# Altium schematic sheet MCU2.SchDoc
size 420 x 297 mm; Address1: Address1; Address2: Address2; Address3: Address3; Address4: Address4; SheetNumber: 4; SheetTotal: 5; Scale: 1:1; DocumentType: Схема электрическая принципиальная
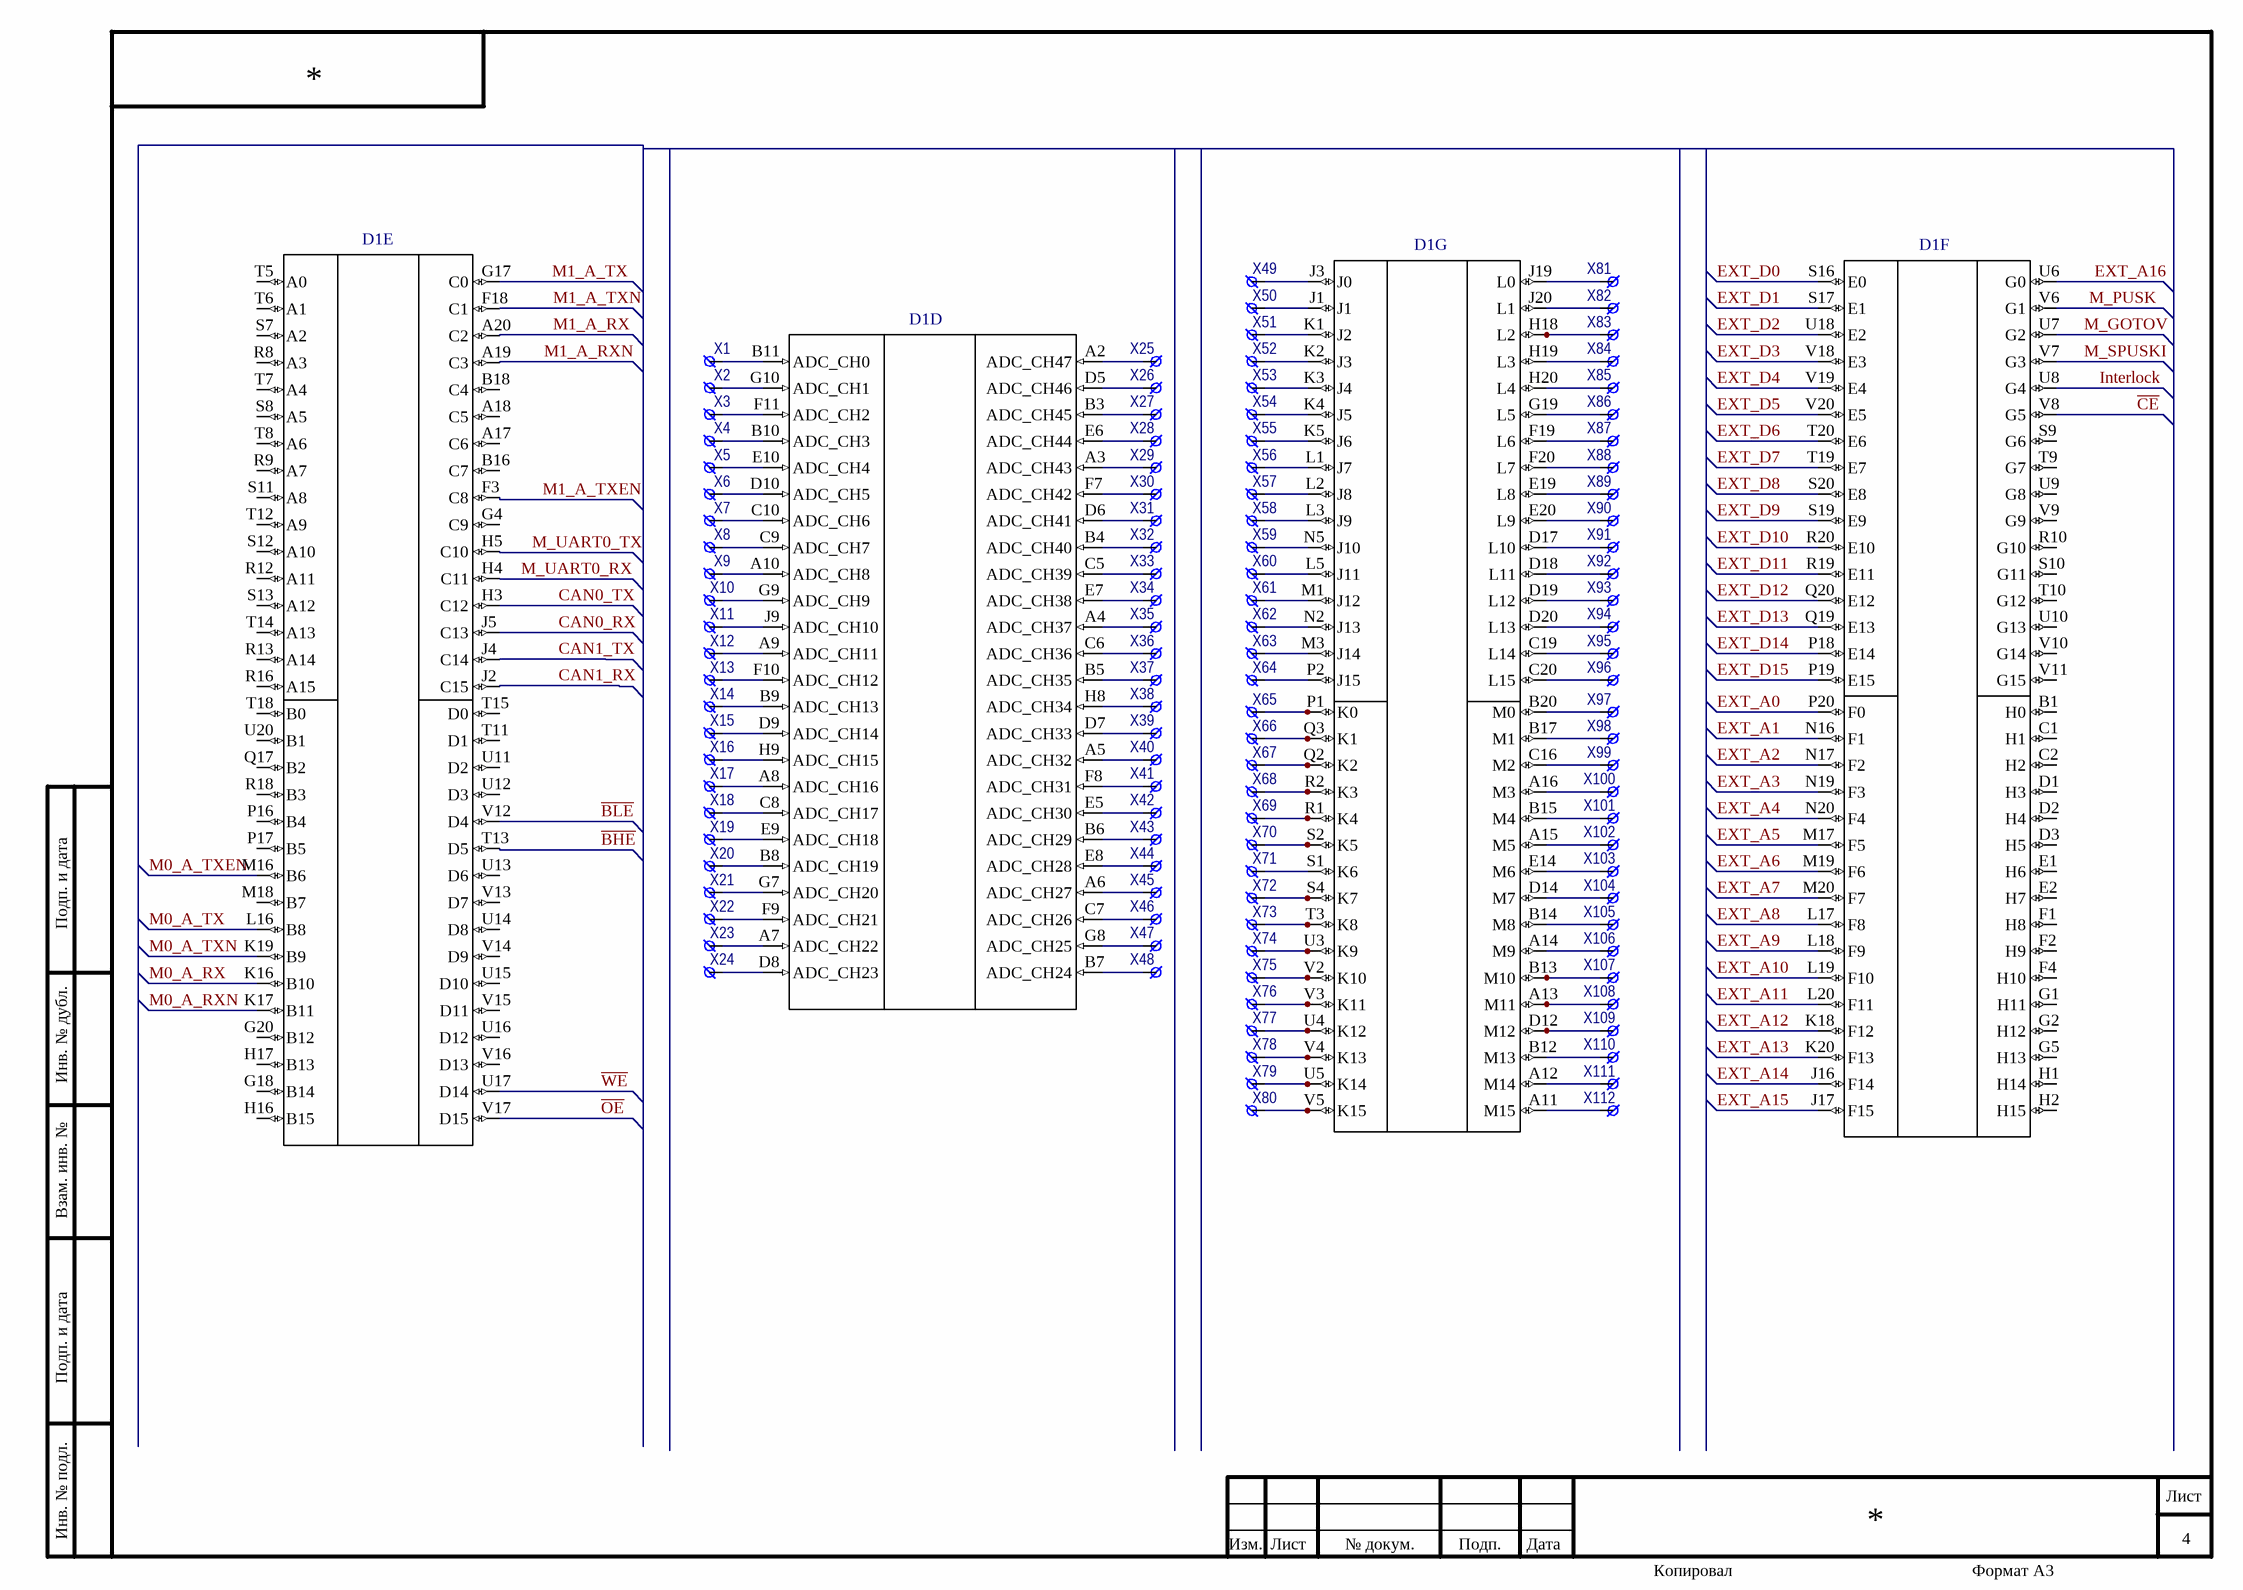
[diagram p0: MCU2.SchDoc]

## Parts
D1  1921ВК028  [BGA-400_21.0X21.0MM_LAYOUT20X20_P1.0MM]  (value not drawn)  (parts D,E,F,G of 8)
X1  CONT  [ПЛАН_ПЛОЩ]  (value not drawn)
X2  CONT  [ПЛАН_ПЛОЩ]  (value not drawn)
X3  CONT  [ПЛАН_ПЛОЩ]  (value not drawn)
X4  CONT  [ПЛАН_ПЛОЩ]  (value not drawn)
X5  CONT  [ПЛАН_ПЛОЩ]  (value not drawn)
X6  CONT  [ПЛАН_ПЛОЩ]  (value not drawn)
X7  CONT  [ПЛАН_ПЛОЩ]  (value not drawn)
X8  CONT  [ПЛАН_ПЛОЩ]  (value not drawn)
X9  CONT  [ПЛАН_ПЛОЩ]  (value not drawn)
X10  CONT  [ПЛАН_ПЛОЩ]  (value not drawn)
X11  CONT  [ПЛАН_ПЛОЩ]  (value not drawn)
X12  CONT  [ПЛАН_ПЛОЩ]  (value not drawn)
X13  CONT  [ПЛАН_ПЛОЩ]  (value not drawn)
X14  CONT  [ПЛАН_ПЛОЩ]  (value not drawn)
X15  CONT  [ПЛАН_ПЛОЩ]  (value not drawn)
X16  CONT  [ПЛАН_ПЛОЩ]  (value not drawn)
X17  CONT  [ПЛАН_ПЛОЩ]  (value not drawn)
X18  CONT  [ПЛАН_ПЛОЩ]  (value not drawn)
X19  CONT  [ПЛАН_ПЛОЩ]  (value not drawn)
X20  CONT  [ПЛАН_ПЛОЩ]  (value not drawn)
X21  CONT  [ПЛАН_ПЛОЩ]  (value not drawn)
X22  CONT  [ПЛАН_ПЛОЩ]  (value not drawn)
X23  CONT  [ПЛАН_ПЛОЩ]  (value not drawn)
X24  CONT  [ПЛАН_ПЛОЩ]  (value not drawn)
X25  CONT  [ПЛАН_ПЛОЩ]  (value not drawn)
X26  CONT  [ПЛАН_ПЛОЩ]  (value not drawn)
X27  CONT  [ПЛАН_ПЛОЩ]  (value not drawn)
X28  CONT  [ПЛАН_ПЛОЩ]  (value not drawn)
X29  CONT  [ПЛАН_ПЛОЩ]  (value not drawn)
X30  CONT  [ПЛАН_ПЛОЩ]  (value not drawn)
X31  CONT  [ПЛАН_ПЛОЩ]  (value not drawn)
X32  CONT  [ПЛАН_ПЛОЩ]  (value not drawn)
X33  CONT  [ПЛАН_ПЛОЩ]  (value not drawn)
X34  CONT  [ПЛАН_ПЛОЩ]  (value not drawn)
X35  CONT  [ПЛАН_ПЛОЩ]  (value not drawn)
X36  CONT  [ПЛАН_ПЛОЩ]  (value not drawn)
X37  CONT  [ПЛАН_ПЛОЩ]  (value not drawn)
X38  CONT  [ПЛАН_ПЛОЩ]  (value not drawn)
X39  CONT  [ПЛАН_ПЛОЩ]  (value not drawn)
X40  CONT  [ПЛАН_ПЛОЩ]  (value not drawn)
X41  CONT  [ПЛАН_ПЛОЩ]  (value not drawn)
X42  CONT  [ПЛАН_ПЛОЩ]  (value not drawn)
X43  CONT  [ПЛАН_ПЛОЩ]  (value not drawn)
X44  CONT  [ПЛАН_ПЛОЩ]  (value not drawn)
X45  CONT  [ПЛАН_ПЛОЩ]  (value not drawn)
X46  CONT  [ПЛАН_ПЛОЩ]  (value not drawn)
X47  CONT  [ПЛАН_ПЛОЩ]  (value not drawn)
X48  CONT  [ПЛАН_ПЛОЩ]  (value not drawn)
X49  CONT  [ПЛАН_ПЛОЩ]  (value not drawn)
X50  CONT  [ПЛАН_ПЛОЩ]  (value not drawn)
X51  CONT  [ПЛАН_ПЛОЩ]  (value not drawn)
X52  CONT  [ПЛАН_ПЛОЩ]  (value not drawn)
X53  CONT  [ПЛАН_ПЛОЩ]  (value not drawn)
X54  CONT  [ПЛАН_ПЛОЩ]  (value not drawn)
X55  CONT  [ПЛАН_ПЛОЩ]  (value not drawn)
X56  CONT  [ПЛАН_ПЛОЩ]  (value not drawn)
X57  CONT  [ПЛАН_ПЛОЩ]  (value not drawn)
X58  CONT  [ПЛАН_ПЛОЩ]  (value not drawn)
X59  CONT  [ПЛАН_ПЛОЩ]  (value not drawn)
X60  CONT  [ПЛАН_ПЛОЩ]  (value not drawn)
X61  CONT  [ПЛАН_ПЛОЩ]  (value not drawn)
X62  CONT  [ПЛАН_ПЛОЩ]  (value not drawn)
X63  CONT  [ПЛАН_ПЛОЩ]  (value not drawn)
X64  CONT  [ПЛАН_ПЛОЩ]  (value not drawn)
X65  CONT  [ПЛАН_ПЛОЩ]  (value not drawn)
X66  CONT  [ПЛАН_ПЛОЩ]  (value not drawn)
X67  CONT  [ПЛАН_ПЛОЩ]  (value not drawn)
X68  CONT  [ПЛАН_ПЛОЩ]  (value not drawn)
X69  CONT  [ПЛАН_ПЛОЩ]  (value not drawn)
X70  CONT  [ПЛАН_ПЛОЩ]  (value not drawn)
X71  CONT  [ПЛАН_ПЛОЩ]  (value not drawn)
X72  CONT  [ПЛАН_ПЛОЩ]  (value not drawn)
X73  CONT  [ПЛАН_ПЛОЩ]  (value not drawn)
X74  CONT  [ПЛАН_ПЛОЩ]  (value not drawn)
X75  CONT  [ПЛАН_ПЛОЩ]  (value not drawn)
X76  CONT  [ПЛАН_ПЛОЩ]  (value not drawn)
X77  CONT  [ПЛАН_ПЛОЩ]  (value not drawn)
X78  CONT  [ПЛАН_ПЛОЩ]  (value not drawn)
X79  CONT  [ПЛАН_ПЛОЩ]  (value not drawn)
X80  CONT  [ПЛАН_ПЛОЩ]  (value not drawn)
X81  CONT  [ПЛАН_ПЛОЩ]  (value not drawn)
X82  CONT  [ПЛАН_ПЛОЩ]  (value not drawn)
X83  CONT  [ПЛАН_ПЛОЩ]  (value not drawn)
X84  CONT  [ПЛАН_ПЛОЩ]  (value not drawn)
X85  CONT  [ПЛАН_ПЛОЩ]  (value not drawn)
X86  CONT  [ПЛАН_ПЛОЩ]  (value not drawn)
X87  CONT  [ПЛАН_ПЛОЩ]  (value not drawn)
X88  CONT  [ПЛАН_ПЛОЩ]  (value not drawn)
X89  CONT  [ПЛАН_ПЛОЩ]  (value not drawn)
X90  CONT  [ПЛАН_ПЛОЩ]  (value not drawn)
X91  CONT  [ПЛАН_ПЛОЩ]  (value not drawn)
X92  CONT  [ПЛАН_ПЛОЩ]  (value not drawn)
X93  CONT  [ПЛАН_ПЛОЩ]  (value not drawn)
X94  CONT  [ПЛАН_ПЛОЩ]  (value not drawn)
X95  CONT  [ПЛАН_ПЛОЩ]  (value not drawn)
X96  CONT  [ПЛАН_ПЛОЩ]  (value not drawn)
X97  CONT  [ПЛАН_ПЛОЩ]  (value not drawn)
X98  CONT  [ПЛАН_ПЛОЩ]  (value not drawn)
X99  CONT  [ПЛАН_ПЛОЩ]  (value not drawn)
X100  CONT  [ПЛАН_ПЛОЩ]  (value not drawn)
X101  CONT  [ПЛАН_ПЛОЩ]  (value not drawn)
X102  CONT  [ПЛАН_ПЛОЩ]  (value not drawn)
X103  CONT  [ПЛАН_ПЛОЩ]  (value not drawn)
X104  CONT  [ПЛАН_ПЛОЩ]  (value not drawn)
X105  CONT  [ПЛАН_ПЛОЩ]  (value not drawn)
X106  CONT  [ПЛАН_ПЛОЩ]  (value not drawn)
X107  CONT  [ПЛАН_ПЛОЩ]  (value not drawn)
X108  CONT  [ПЛАН_ПЛОЩ]  (value not drawn)
X109  CONT  [ПЛАН_ПЛОЩ]  (value not drawn)
X110  CONT  [ПЛАН_ПЛОЩ]  (value not drawn)
X111  CONT  [ПЛАН_ПЛОЩ]  (value not drawn)
X112  CONT  [ПЛАН_ПЛОЩ]  (value not drawn)

## Nets
~{BHE}: D1.T13(D5)
~{BLE}: D1.V12(D4)
~{CE}: D1.V8(G5)
~{OE}: D1.V17(D15)
~{WE}: D1.U17(D14)
CAN0_RX: D1.J5(C13)
CAN0_TX: D1.H3(C12)
CAN1_RX: D1.J2(C15)
CAN1_TX: D1.J4(C14)
EXT_A0: D1.P20(F0)
EXT_A1: D1.N16(F1)
EXT_A2: D1.N17(F2)
EXT_A3: D1.N19(F3)
EXT_A4: D1.N20(F4)
EXT_A5: D1.M17(F5)
EXT_A6: D1.M19(F6)
EXT_A7: D1.M20(F7)
EXT_A8: D1.L17(F8)
EXT_A9: D1.L18(F9)
EXT_A10: D1.L19(F10)
EXT_A11: D1.L20(F11)
EXT_A12: D1.K18(F12)
EXT_A13: D1.K20(F13)
EXT_A14: D1.J16(F14)
EXT_A15: D1.J17(F15)
EXT_A16: D1.U6(G0)
EXT_D0: D1.S16(E0)
EXT_D1: D1.S17(E1)
EXT_D2: D1.U18(E2)
EXT_D3: D1.V18(E3)
EXT_D4: D1.V19(E4)
EXT_D5: D1.V20(E5)
EXT_D6: D1.T20(E6)
EXT_D7: D1.T19(E7)
EXT_D8: D1.S20(E8)
EXT_D9: D1.S19(E9)
EXT_D10: D1.R20(E10)
EXT_D11: D1.R19(E11)
EXT_D12: D1.Q20(E12)
EXT_D13: D1.Q19(E13)
EXT_D14: D1.P18(E14)
EXT_D15: D1.P19(E15)
Interlock: D1.U8(G4)
M0_A_RX: D1.K16(B10)
M0_A_RXN: D1.K17(B11)
M0_A_TX: D1.L16(B8)
M0_A_TXEN: D1.M16(B6)
M0_A_TXN: D1.K19(B9)
M1_A_RX: D1.A20(C2)
M1_A_RXN: D1.A19(C3)
M1_A_TX: D1.G17(C0)
M1_A_TXEN: D1.F3(C8)
M1_A_TXN: D1.F18(C1)
M_GOTOV: D1.U7(G2)
M_PUSK: D1.V6(G1)
M_SPUSKI: D1.V7(G3)
M_UART0_RX: D1.H4(C11)
M_UART0_TX: D1.H5(C10)
NetD1_A2: D1.A2(ADC_CH47) X25.1
NetD1_A3: D1.A3(ADC_CH43) X29.1
NetD1_A4: D1.A4(ADC_CH37) X35.1
NetD1_A5: D1.A5(ADC_CH32) X40.1
NetD1_A6: D1.A6(ADC_CH27) X45.1
NetD1_A7: D1.A7(ADC_CH22) X23.1
NetD1_A8: D1.A8(ADC_CH16) X17.1
NetD1_A9: D1.A9(ADC_CH11) X12.1
NetD1_A10: D1.A10(ADC_CH8) X9.1
NetD1_A11: D1.A11(M15) X112.1
NetD1_A12: D1.A12(M14) X111.1
NetD1_A13: D1.A13(M11) X108.1
NetD1_A14: D1.A14(M9) X106.1
NetD1_A15: D1.A15(M5) X102.1
NetD1_A16: D1.A16(M3) X100.1
NetD1_B3: D1.B3(ADC_CH45) X27.1
NetD1_B4: D1.B4(ADC_CH40) X32.1
NetD1_B5: D1.B5(ADC_CH35) X37.1
NetD1_B6: D1.B6(ADC_CH29) X43.1
NetD1_B7: D1.B7(ADC_CH24) X48.1
NetD1_B8: D1.B8(ADC_CH19) X20.1
NetD1_B9: D1.B9(ADC_CH13) X14.1
NetD1_B10: D1.B10(ADC_CH3) X4.1
NetD1_B11: D1.B11(ADC_CH0) X1.1
NetD1_B12: D1.B12(M13) X110.1
NetD1_B13: D1.B13(M10) X107.1
NetD1_B14: D1.B14(M8) X105.1
NetD1_B15: D1.B15(M4) X101.1
NetD1_B17: D1.B17(M1) X98.1
NetD1_B20: D1.B20(M0) X97.1
NetD1_C5: D1.C5(ADC_CH39) X33.1
NetD1_C6: D1.C6(ADC_CH36) X36.1
NetD1_C7: D1.C7(ADC_CH26) X46.1
NetD1_C8: D1.C8(ADC_CH17) X18.1
NetD1_C9: D1.C9(ADC_CH7) X8.1
NetD1_C10: D1.C10(ADC_CH6) X7.1
NetD1_C16: D1.C16(M2) X99.1
NetD1_C19: D1.C19(L14) X95.1
NetD1_C20: D1.C20(L15) X96.1
NetD1_D5: D1.D5(ADC_CH46) X26.1
NetD1_D6: D1.D6(ADC_CH41) X31.1
NetD1_D7: D1.D7(ADC_CH33) X39.1
NetD1_D8: D1.D8(ADC_CH23) X24.1
NetD1_D9: D1.D9(ADC_CH14) X15.1
NetD1_D10: D1.D10(ADC_CH5) X6.1
NetD1_D12: D1.D12(M12) X109.1
NetD1_D14: D1.D14(M7) X104.1
NetD1_D17: D1.D17(L10) X91.1
NetD1_D18: D1.D18(L11) X92.1
NetD1_D19: D1.D19(L12) X93.1
NetD1_D20: D1.D20(L13) X94.1
NetD1_E5: D1.E5(ADC_CH30) X42.1
NetD1_E6: D1.E6(ADC_CH44) X28.1
NetD1_E7: D1.E7(ADC_CH38) X34.1
NetD1_E8: D1.E8(ADC_CH28) X44.1
NetD1_E9: D1.E9(ADC_CH18) X19.1
NetD1_E10: D1.E10(ADC_CH4) X5.1
NetD1_E14: D1.E14(M6) X103.1
NetD1_E19: D1.E19(L8) X89.1
NetD1_E20: D1.E20(L9) X90.1
NetD1_F7: D1.F7(ADC_CH42) X30.1
NetD1_F8: D1.F8(ADC_CH31) X41.1
NetD1_F9: D1.F9(ADC_CH21) X22.1
NetD1_F10: D1.F10(ADC_CH12) X13.1
NetD1_F11: D1.F11(ADC_CH2) X3.1
NetD1_F19: D1.F19(L6) X87.1
NetD1_F20: D1.F20(L7) X88.1
NetD1_G7: D1.G7(ADC_CH20) X21.1
NetD1_G8: D1.G8(ADC_CH25) X47.1
NetD1_G9: D1.G9(ADC_CH9) X10.1
NetD1_G10: D1.G10(ADC_CH1) X2.1
NetD1_G19: D1.G19(L5) X86.1
NetD1_H8: D1.H8(ADC_CH34) X38.1
NetD1_H9: D1.H9(ADC_CH15) X16.1
NetD1_H18: D1.H18(L2) X83.1
NetD1_H19: D1.H19(L3) X84.1
NetD1_H20: D1.H20(L4) X85.1
NetD1_J1: D1.J1 X50.1
NetD1_J3: D1.J3(J0) X49.1
NetD1_J9: D1.J9(ADC_CH10) X11.1
NetD1_J19: D1.J19(L0) X81.1
NetD1_J20: D1.J20(L1) X82.1
NetD1_K1: D1.K1(J2) X51.1
NetD1_K2: D1.K2(J3) X52.1
NetD1_K3: D1.K3(J4) X53.1
NetD1_K4: D1.K4(J5) X54.1
NetD1_K5: D1.K5(J6) X55.1
NetD1_L1: D1.L1(J7) X56.1
NetD1_L2: D1.L2(J8) X57.1
NetD1_L3: D1.L3(J9) X58.1
NetD1_L5: D1.L5(J11) X60.1
NetD1_M1: D1.M1(J12) X61.1
NetD1_M3: D1.M3(J14) X63.1
NetD1_N2: D1.N2(J13) X62.1
NetD1_N5: D1.N5(J10) X59.1
NetD1_P1: D1.P1(K0) X65.1
NetD1_P2: D1.P2(J15) X64.1
NetD1_Q2: D1.Q2(K2) X67.1
NetD1_Q3: D1.Q3(K1) X66.1
NetD1_R1: D1.R1(K4) X69.1
NetD1_R2: D1.R2(K3) X68.1
NetD1_S1: D1.S1(K6) X71.1
NetD1_S2: D1.S2(K5) X70.1
NetD1_S4: D1.S4(K7) X72.1
NetD1_T3: D1.T3(K8) X73.1
NetD1_U3: D1.U3(K9) X74.1
NetD1_U4: D1.U4(K12) X77.1
NetD1_U5: D1.U5(K14) X79.1
NetD1_V2: D1.V2(K10) X75.1
NetD1_V3: D1.V3(K11) X76.1
NetD1_V4: D1.V4(K13) X78.1
NetD1_V5: D1.V5(K15) X80.1

Not connected (* = marked no-connect by the designer): D1 A17(C6) A18(C5) B1(H0) B16(C7) B18(C4) C1(H1) C2(H2) D1(H3) D2(H4) D3(H5) E1(H6) E2(H7) F1(H8) F2(H9) F4(H10) G1(H11) G2(H12) G4(C9) G5(H13) G18(B14) G20(B12) H1(H14) H2(H15) H16(B15) H17(B13) M18(B7) P16(B4) P17(B5) Q17(B2) R8(A3) R9(A7) R10(G10) R12(A11) R13(A14) R16(A15) R18(B3) S7(A2) S8(A5) S9(G6) S10(G11) S11(A8) S12(A10) S13(A12) T5(A0) T6(A1) T7(A4) T8(A6) T9(G7) T10(G12) T11(D1) T12(A9) T14(A13) T15(D0) T18(B0) U9(G8) U10(G13) U11(D2) U12(D3) U13(D6) U14(D8) U15(D10) U16(D12) U20(B1) V9(G9) V10(G14) V11(G15) V13(D7) V14(D9) V15(D11) V16(D13)

## Notes on the sheet
- Подп. и дата
- Инв. № дубл.
- Взам. инв. №
- Инв. № подл.
- Изм.
- Лист
- № докум.
- Подп.
- Дата
- Копировал
- Формат А3

## Library data of the parts
D1 = 1921ВК028: МК 1921ВК028; TypePrefix: Микроконтроллер; TU: АЕНВ.431290.444ТУ; TUHolder: АО «НИИЭТ», Россия, г.Воронеж; Prefix: D; TypeName: Микросхемы интегральные; Value: *; PartNumber: 1921ВК028
X1-X112 = CONT: CONT1_SMD; PartNumber: контактное поле; Value: *